# Altium schematic sheet mcu-supply.SchDoc
size A3; DocumentNumber: 27; SheetNumber: 27; SheetTotal: 45; SheetDescription: MCU Power Supply
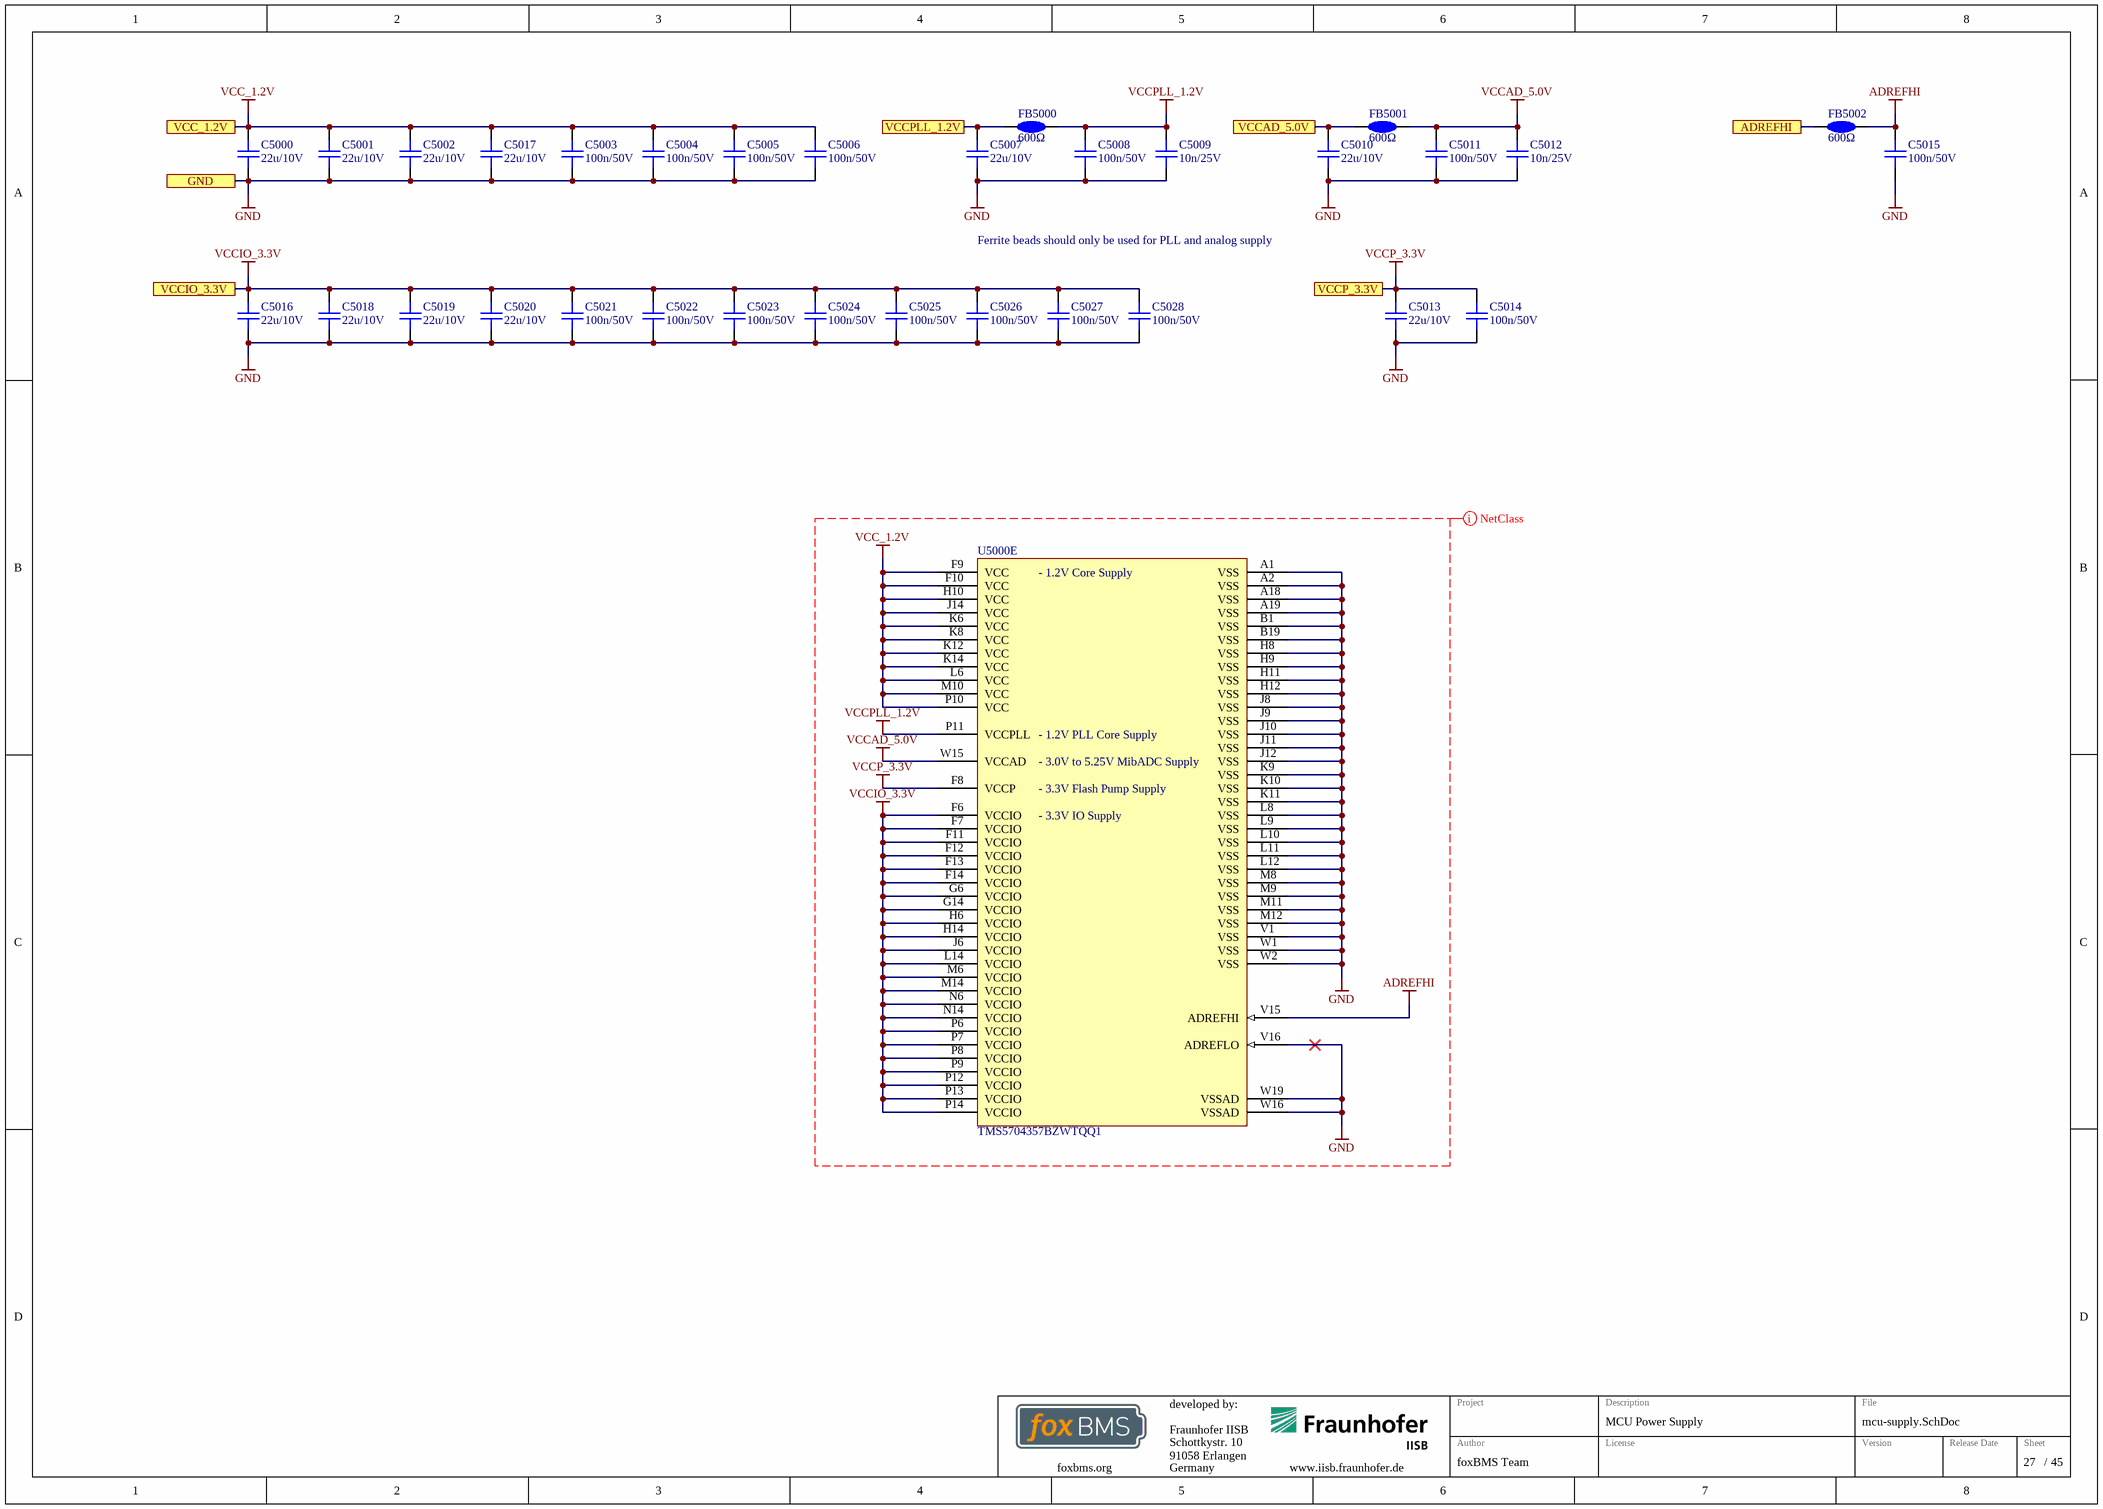
[diagram p0: mcu-supply.SchDoc]

## Parts
C5000  22u/10V  [CAPC3216X18N]
C5001  22u/10V  [CAPC3216X18N]
C5002  22u/10V  [CAPC3216X18N]
C5003  100n/50V  [CAPC1005X06N]
C5004  100n/50V  [CAPC1005X06N]
C5005  100n/50V  [CAPC1005X06N]
C5006  100n/50V  [CAPC1005X06N]
C5007  22u/10V  [CAPC3216X18N]
C5008  100n/50V  [CAPC1005X06N]
C5009  10n/25V  [CAPC1005X06N]
C5010  22u/10V  [CAPC3216X18N]
C5011  100n/50V  [CAPC1005X06N]
C5012  10n/25V  [CAPC1005X06N]
C5013  22u/10V  [CAPC3216X18N]
C5014  100n/50V  [CAPC1005X06N]
C5015  100n/50V  [CAPC1005X06N]
C5016  22u/10V  [CAPC3216X18N]
C5017  22u/10V  [CAPC3216X18N]
C5018  22u/10V  [CAPC3216X18N]
C5019  22u/10V  [CAPC3216X18N]
C5020  22u/10V  [CAPC3216X18N]
C5021  100n/50V  [CAPC1005X06N]
C5022  100n/50V  [CAPC1005X06N]
C5023  100n/50V  [CAPC1005X06N]
C5024  100n/50V  [CAPC1005X06N]
C5025  100n/50V  [CAPC1005X06N]
C5026  100n/50V  [CAPC1005X06N]
C5027  100n/50V  [CAPC1005X06N]
C5028  100n/50V  [CAPC1005X06N]
FB5000  600Ω  [RESC1005X04N]
FB5001  600Ω  [RESC1005X04N]
FB5002  600Ω  [RESC1005X04N]
U5000  TMS5704357BZWTQQ1  [BGA337C80P19X19_1600X1600X140]  (part E of 6)

## Ports
ADREFHI, GND, VCC_1.2V, VCCAD_5.0V, VCCIO_3.3V, VCCP_3.3V, VCCPLL_1.2V

## Nets
ADREFHI: C5015.2 FB5002.2 U5000.V15(ADREFHI)
GND: C5000.1 C5001.1 C5002.1 C5003.1 C5004.1 C5005.1 C5006.1 C5007.1 C5008.1 C5009.1 C5010.1 C5011.1 C5012.1 C5013.1 C5014.1 C5015.1 C5016.1 C5017.1 C5018.1 C5019.1 C5020.1 C5021.1 C5022.1 C5023.1 C5024.1 C5025.1 C5026.1 C5027.1 C5028.1 U5000.A1(VSS) U5000.A2(VSS) U5000.A18(VSS) U5000.A19(VSS) U5000.B1(VSS) U5000.B19(VSS) U5000.H8(VSS) U5000.H9(VSS) U5000.H11(VSS) U5000.H12(VSS) U5000.J8(VSS) U5000.J9(VSS) U5000.J10(VSS) U5000.J11(VSS) U5000.J12(VSS) U5000.K9(VSS) U5000.K10(VSS) U5000.K11(VSS) U5000.L8(VSS) U5000.L9(VSS) U5000.L10(VSS) U5000.L11(VSS) U5000.L12(VSS) U5000.M8(VSS) U5000.M9(VSS) U5000.M11(VSS) U5000.M12(VSS) U5000.V1(VSS) U5000.V16(ADREFLO) U5000.W1(VSS) U5000.W2(VSS) U5000.W16(VSSAD) U5000.W19(VSSAD) ; port GND
VCC_1.2V: C5000.2 C5001.2 C5002.2 C5003.2 C5004.2 C5005.2 C5006.2 C5017.2 U5000.F9(VCC) U5000.F10(VCC) U5000.H10(VCC) U5000.J14(VCC) U5000.K6(VCC) U5000.K8(VCC) U5000.K12(VCC) U5000.K14(VCC) U5000.L6(VCC) U5000.M10(VCC) U5000.P10(VCC) ; port VCC_1.2V
VCCAD_5.0V: C5011.2 C5012.2 FB5001.2 U5000.W15(VCCAD)
VCCIO_3.3V: C5016.2 C5018.2 C5019.2 C5020.2 C5021.2 C5022.2 C5023.2 C5024.2 C5025.2 C5026.2 C5027.2 C5028.2 U5000.F6(VCCIO) U5000.F7(VCCIO) U5000.F11(VCCIO) U5000.F12(VCCIO) U5000.F13(VCCIO) U5000.F14(VCCIO) U5000.G6(VCCIO) U5000.G14(VCCIO) U5000.H6(VCCIO) U5000.H14(VCCIO) U5000.J6(VCCIO) U5000.L14(VCCIO) U5000.M6(VCCIO) U5000.M14(VCCIO) U5000.N6(VCCIO) U5000.N14(VCCIO) U5000.P6(VCCIO) U5000.P7(VCCIO) U5000.P8(VCCIO) U5000.P9(VCCIO) U5000.P12(VCCIO) U5000.P13(VCCIO) U5000.P14(VCCIO) ; port VCCIO_3.3V
VCCP_3.3V: C5013.2 C5014.2 U5000.F8(VCCP) ; port VCCP_3.3V
VCCPLL_1.2V: C5008.2 C5009.2 FB5000.2 U5000.P11(VCCPLL)
ADREFHI: FB5002.1 ; port ADREFHI  [a separate net that carries the same name]
VCCAD_5.0V: C5010.2 FB5001.1 ; port VCCAD_5.0V  [a separate net that carries the same name]
VCCPLL_1.2V: C5007.2 FB5000.1 ; port VCCPLL_1.2V  [a separate net that carries the same name]

## Layout directives
net class MCU_Supply: ADREFHI, GND, VCC_1.2V, VCCAD_5.0V, VCCIO_3.3V, VCCP_3.3V, VCCPLL_1.2V

## Notes on the sheet
- Ferrite beads should only be used for PLL and analog supply
- Fraunhofer IISB
- Schottkystr. 10
- developed by:
- 91058 Erlangen
- Germany
- Author
- Project
- License
- Description
- File
- Version
- Release Date
- Sheet
- foxbms.org <https://foxbms.org>
- www.iisb.fraunhofer.de <https://www.iisb.fraunhofer.de/>
- foxBMS Team
- /
- (in symbol TMS5704357BZWTQQ1, part E) - 1.2V Core Supply; - 1.2V PLL Core Supply; - 3.0V to 5.25V MibADC Supply; - 3.3V Flash Pump Supply; - 3.3V IO Supply

## Library data of the parts
C5000-C5002 C5007 C5010 C5013 C5016-C5020 = gen_C_ceramic_22u_10V_X7R_1206: MLCC; Capacitance: 22u; Rated Voltage: 10V; Dielectric: X7R; Case EIA: 1206; Case Metric: 3216; Automotive Qualified: True; Part Number: gen_C_ceramic_22u_10V_X7R_1206; Supplier 1: Digikey; Supplier Part Number 1: 587-4243-1-ND
C5003-C5006 C5008 C5011 C5014 C5015 C5021-C5028 = gen_C_ceramic_100n_50V_X7R_0402: MLCC; Capacitance: 100n; Rated Voltage: 50V; Dielectric: X7R; Case EIA: 0402; Case Metric: 1005; PnP Package: 0402C; PnP Value: 100nF/50V/X7R; PnP equipped: x; Automotive Qualified: True; AEC-Q Norm: AEC-Q200; Part Number: gen_C_ceramic_100n_50V_X7R_0402; Supplier 1: Farnell; Supplier Part Number 1: 2210822; ECCN: EAR99
C5009 C5012 = gen_C_ceramic_10n_25V_X7R_0402: MLCC; Capacitance: 10n; Rated Voltage: 25V; Dielectric: X7R; Case EIA: 0402; Case Metric: 1005; Automotive Qualified: True; PnP Package: 0402C; PnP Value: 10nF/25V/X7R; PnP equipped: x; Part Number: gen_C_ceramic_10n_25V_X7R_0402; Supplier 1: Farnell; Supplier Part Number 1: 2210793
FB5000-FB5002 = gen_Ferrite_600R_0402: Ferrite Bead; Manufacturer: TDK; Saturation Current: 200mA; Automotive Qualified: True; Part Number: gen_Ferrite_600R_0402; Operating Temperature: -55°C - +125°C; Inductance: 600Ω; Supplier 1: Digikey; Supplier Part Number 1: 445-172776-1-ND; Supplier 2: Mouser; Supplier Part Number 2: 810-MMZ1005B601CTD25